# Altium schematic sheet Modbus RTU.SchDoc
size 250 x 80 mm; SheetNumber: 5; SheetTotal: 5
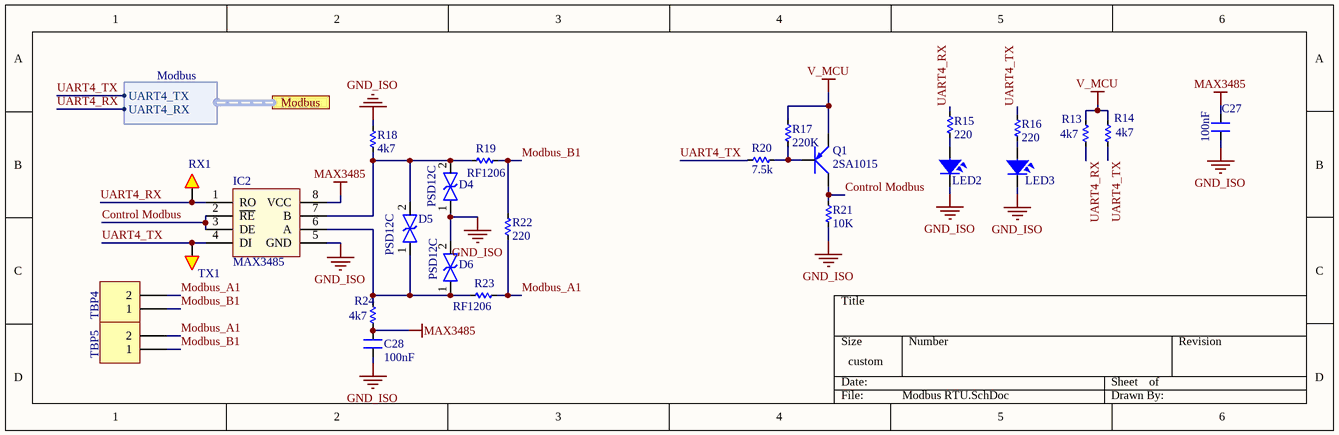
[diagram p0: Modbus RTU.SchDoc]

## Parts
B3  RX1  [Test]
B4  TX1  [Test]
C27  100nF  [CN-SMD-0603]
C28  100nF  [CN-SMD-0603]
D4  PSD12C  [PSD12C]
D5  PSD12C  [PSD12C]
D6  PSD12C  [PSD12C]
IC2  MAX3485  [SO8]
LED2  LED  [LED-0805-Blue]  (value not drawn)
LED3  LED  [LED-0805-Blue]  (value not drawn)
Q1  2SA1015  [SOT23-321]
R13  4k7  [RES-SMD-0603]
R14  4k7  [RES-SMD-0603]
R15  220  [RES-SMD-0603]
R16  220  [RES-SMD-0603]
R17  220K  [RES-SMD-0603]
R18  4k7  [RES-SMD-0603]
R19  RF1206  [RES-SMD-1206]
R20  7.5k  [RES-SMD-0603]
R21  10K  [RES-SMD-0603]
R22  220  [RES-SMD-0603]
R23  RF1206  [RES-SMD-1206]
R24  4k7  [RES-SMD-0603]
TBP4  WE-Terminal Blocks Plugable Type 691322310002  [Terminal_Blocks_Pluggable_Socket__Right_Angle__3.81_mm_Pitch__2_Position]  (value not drawn)
TBP5  WE-Terminal Blocks Plugable Type 691322310002  [Terminal_Blocks_Pluggable_Socket__Right_Angle__3.81_mm_Pitch__2_Position]  (value not drawn)

## Ports
Modbus (harness Modbus)

## Harnesses
Modbus: UART4_TX, UART4_RX

## Nets
GND_ISO: C27.1 C28.2 D4.1 D6.2 IC2.5(GND) LED2.2 LED3.2 R18.1 R21.1
MAX3485: C27.2 C28.1 IC2.8(VCC) R24.1
V_MCU: Q1.1(E) R13.1 R14.1 R17.2
Control Modbus: IC2.2(~{RE}) IC2.3(DE) Q1.2(C) R21.2
Modbus_A1: R22.2 R23.1 TBP4.2 TBP5.2
Modbus_B1: R19.1 R22.1 TBP4.1 TBP5.1
UART4_RX: B3.1 IC2.1(RO) R13.2 R15.1 ; port Modbus.UART4_RX
UART4_TX: B4.1 IC2.4(DI) R14.2 R16.1 R20.1 ; port Modbus.UART4_TX
NetD4_2: D4.2 D5.2 IC2.7(B) R18.2 R19.2
NetD5_1: D5.1 D6.1 IC2.6(A) R23.2 R24.2
NetLED2_1: LED2.1 R15.2
NetLED3_1: LED3.1 R16.2
NetQ1_3: Q1.3(B) R17.1 R20.2

## Notes on the sheet
- Title
- Size:
- Date:
- A3
- Number:
- Time:
- Revision:
- Sheet
- of
- NICHIETSUVN.COM <http://NICHIETSUVN.COM>
- R&D
- File:

## Library data of the parts
B3 B4 = Test: WR-PHD 2.54 mm Angled Socket Header; Manufacturer: W¨¹rth Elektronik eiSos GmbH; partNo: 613002143121; ComponentLink1 Description: Manufacturer; ComponentLink2 Description: Datasheet; NoPins: 02; Created Date: 29 March 2013; ComponentLink1URL: http://www.we-online.com; ComponentLink2URL: http://katalog.we-online.de/em/datasheet/6130xx143121.pdf; Created by: Karrer Zheng
C27 C28 = CN: Value: 33pF
D4-D6 = PSD12C: diode tvs
IC2 = MAX485: RS232 - RS485 (Same sn75176)
LED2 LED3 = LED SMD: Value: LED 3 - 5 ly 2 Colour
Q1 = 2SA1015: PNP 600mW, ECB; Value: A1015
R13-R24 = Res-SMD: Resistor; Manufacturer: Generic Components; Class: Passive; Published: 08/06/2000; Publisher: Altium Hobart Technology Centre
TBP4 TBP5 = Terminal_Blocks_Pluggable_Socket__Right_Angle__3.81_mm_Pitch__2_Position: WR-TBL Terminal block - serie 322 - 3.81 mm; Manufacturer 1: W¨¹rth Elektronik eiSos GmbH; ComponentLink1 Description: Manufacturer; ComponentLink2 Description: Datasheet; NoPins: 02; Pcs 2: 1; ComponentLink1URL: http://www.we-online.com; ComponentLink2URL: http://katalog.we-online.de/em/datasheet/6913223100xx.pdf; Supplier 1: Digi-Key; Supplier Part Number 1: *; Supplier 2: https://www.thegioiic.com; Manufacturer Part Number 1: 691322310002; Supplier Part Number 2: https://www.thegioiic.com/products/kf-3-81-2-r-terminal-block-plug-in-han-pcb-2-chan-cong-3-81mm; Price 2: 2000